# Altium schematic sheet sensor.SchDoc
size A3
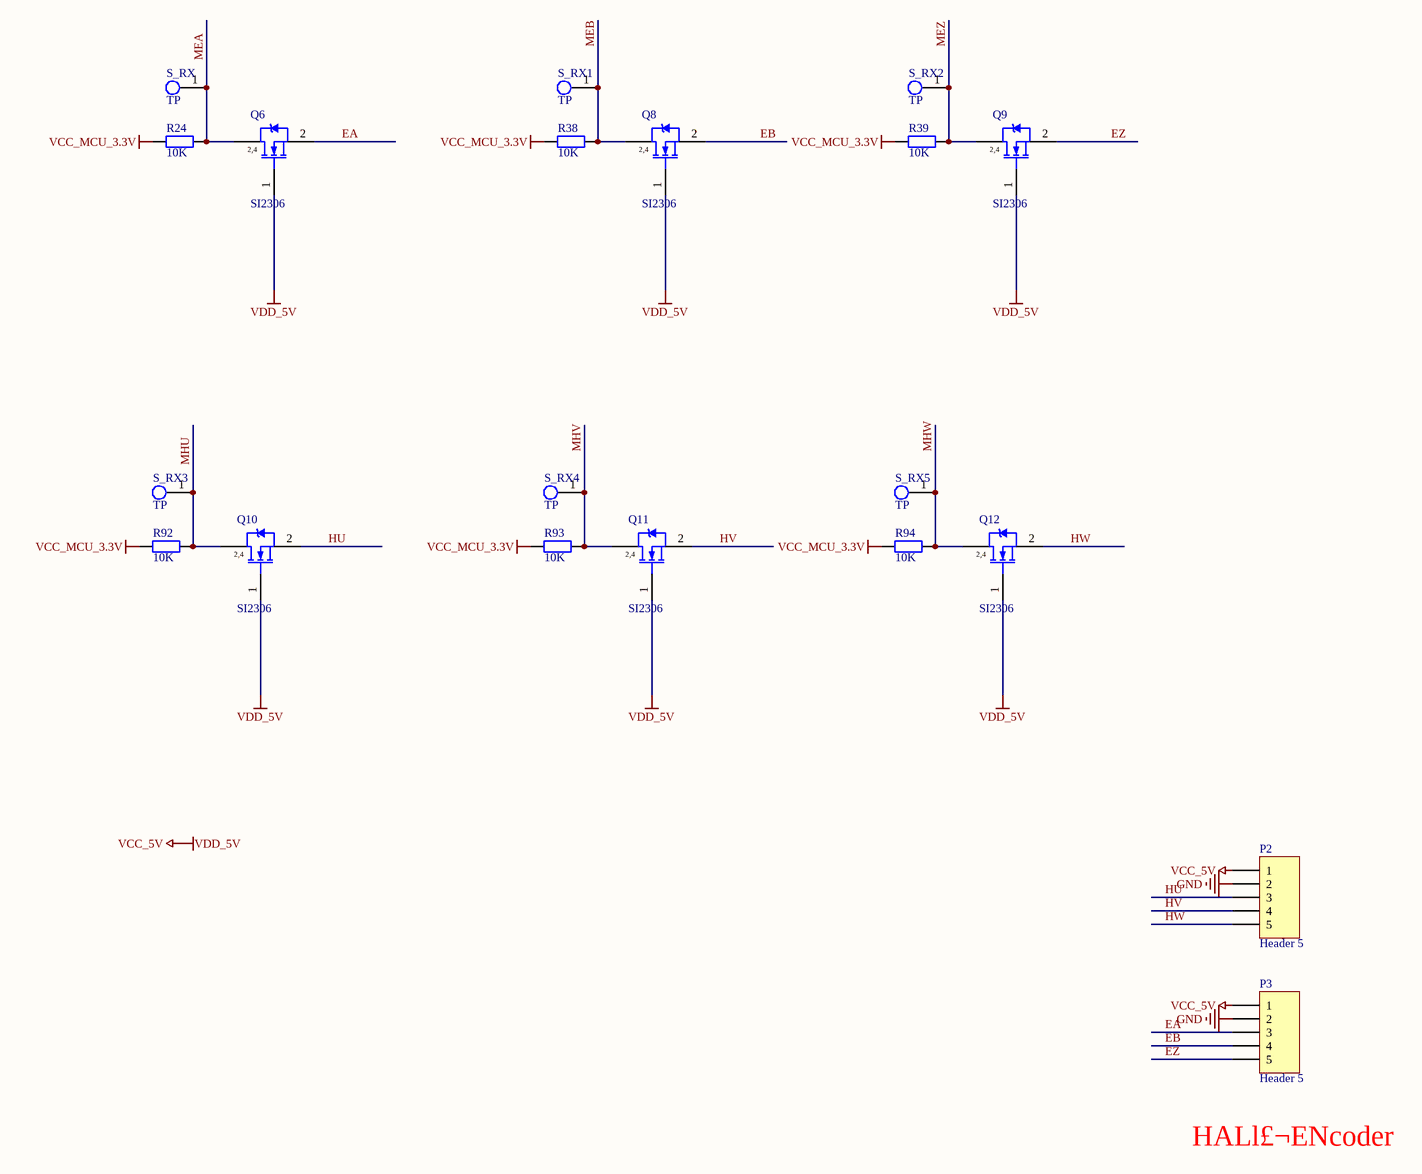
[diagram p0: sensor.SchDoc]

## Parts
P2  Header 5  [HDR1X5]
P3  Header 5  [HDR1X5]
Q6  SI2306  [SOT23-3]
Q8  SI2306  [SOT23-3]
Q9  SI2306  [SOT23-3]
Q10  SI2306  [SOT23-3]
Q11  SI2306  [SOT23-3]
Q12  SI2306  [SOT23-3]
R24  10K  [0603R]
R38  10K  [0603R]
R39  10K  [0603R]
R92  10K  [0603R]
R93  10K  [0603R]
R94  10K  [0603R]
S_RX  TP  [TPD]
S_RX1  TP  [TPD]
S_RX2  TP  [TPD]
S_RX3  TP  [TPD]
S_RX4  TP  [TPD]
S_RX5  TP  [TPD]

## Nets
GND: P2.2 P3.2
VCC_5V: P2.1 P3.1 Q6.1(G) Q8.1(G) Q9.1(G) Q10.1(G) Q11.1(G) Q12.1(G)  [also labelled VDD_5V]
VCC_MCU_3.3V: R24.1 R38.1 R39.1 R92.1 R93.1 R94.1
EA: P3.3 Q6.2(S)
EB: P3.4 Q8.2(S)
EZ: P3.5 Q9.2(S)
HU: P2.3 Q10.2(S)
HV: P2.4 Q11.2(S)
HW: P2.5 Q12.2(S)
MEA: Q6.3(D) R24.2 S_RX.1
MEB: Q8.3(D) R38.2 S_RX1.1
MEZ: Q9.3(D) R39.2 S_RX2.1
MHU: Q10.3(D) R92.2 S_RX3.1
MHV: Q11.3(D) R93.2 S_RX4.1
MHW: Q12.3(D) R94.2 S_RX5.1

## Notes on the sheet
- HALl£¬ENcoder
- (in symbol BUK92150-55A) 2,4

## Library data of the parts
P2 P3 = Header 5: Header, 5-Pin; LatestRevisionDate: 17-Jul-2002; LatestRevisionNote: Re-released for DXP Platform.; Publisher: Altium Limited
Q6 Q8-Q12 = BUK92150-55A: Published: 8-Jun-2000; LatestRevisionDate: 17-Jul-2002; LatestRevisionNote: Re-released for DXP Platform.; DatasheetVersion: 6-Oct-1997; PackageVersion: Aug-1998; PackageReference: TSOP-6; Publisher: Altium Limited; PackageDescription: SOT-457/SC-74; 6 Leads; Body 3.1 x 3 mm, inc. leads (LxW max); ComponentLink1Description: Manufacturer Link; ComponentLink1URL: http://www.vishay.com/; ComponentLink2Description: Datasheet; ComponentLink2URL: http://www.vishay.com/docs/70192/70192.pdf
R24 R38 R39 R92-R94 = Res2: Resistor; Value: 10R; Published: 8-Jun-2000; LatestRevisionDate: 17-Jul-2002; LatestRevisionNote: Re-released for DXP Platform.; PackageReference: AXIAL-0.4; Publisher: Altium Limited